# EAGLE design main (EAGLE 9.5.1)
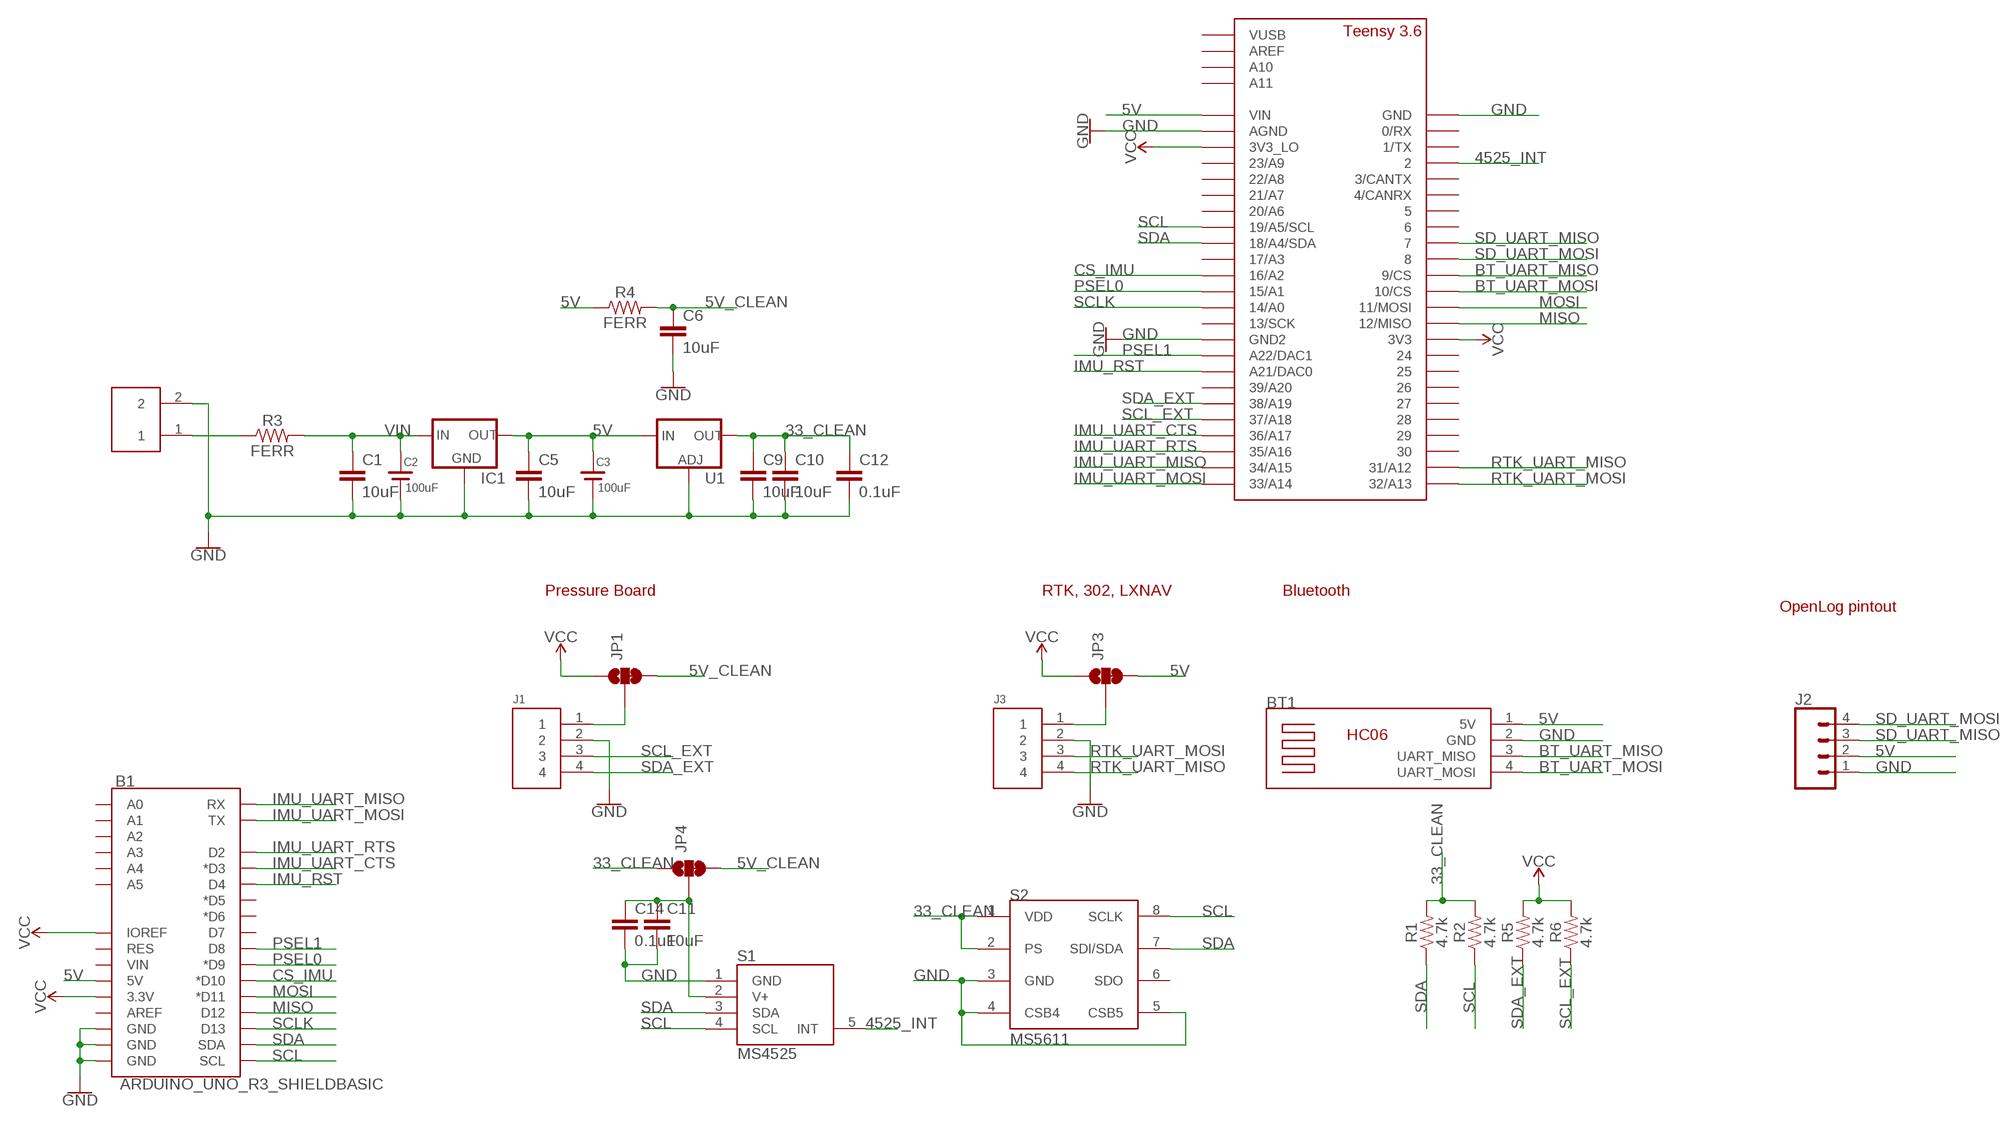
[diagram p0: schematic, sheet 1]

## Parts
B1  ARDUINO_UNO_R3_SHIELDBASIC  [UNO_R3_SHIELD]
BT1  HC06  [HC06]
C1  10uF  10UF-1206-6.3V-20%  [1206]
C2  100uF  CAP_POLARCAP_8_DIA_35_LEAD  [CAP_8MM_35MM]
C3  100uF  CAP_POLARCAP_8_DIA_35_LEAD  [CAP_8MM_35MM]
C5  10uF  10UF-1206-6.3V-20%  [1206]
C6  10uF  10UF-1206-6.3V-20%  [1206]
C9  10uF  10UF-1206-6.3V-20%  [1206]
C10  10uF  10UF-1206-6.3V-20%  [1206]
C11  10uF  10UF-1206-6.3V-20%  [1206]
C12  0.1uF  0.1UF-0603-25V-5%  [0603]
C14  0.1uF  0.1UF-0603-25V-5%  [0603]
IC1  V_REG_78XXR-78E  [V78W]
J1  HEADER4VALULOK  [4PINVALULOK]
J2  CONN_04  [1X04]
J3  HEADER4VALULOK  [4PINVALULOK]
JP1  JUMPER-SMT_3_1-NC_TRACE_SILK  [SMT-JUMPER_3_1-NC_TRACE_SILK]
JP3  JUMPER-SMT_3_1-NC_TRACE_SILK  [SMT-JUMPER_3_1-NC_TRACE_SILK]
JP4  JUMPER-SMT_3_1-NC_TRACE_SILK  [SMT-JUMPER_3_1-NC_TRACE_SILK]
R1  4.7k  4.7KOHM-0603-1/10W-1%  [0603]
R2  4.7k  4.7KOHM-0603-1/10W-1%  [0603]
R3  FERR  RESISTOR1206  [1206]
R4  FERR  RESISTOR1206  [1206]
R5  4.7k  4.7KOHM-0603-1/10W-1%  [0603]
R6  4.7k  4.7KOHM-0603-1/10W-1%  [0603]
S1  MS4525  MS4525MS4525DO  [DIP1270W53P254L990H762Q8B]
S2  MS5611  [MS5611]
U1  V_REG_317SMD  [SOT223]
U$1  TEENSY_3.5/3.6_BASIC  [TEENSY_3.5/3.6_BASIC]
U$3  HEADER2  [2PINVALULOK]

## Nets
5V: B1.5V BT1.1(5V) C3.POS(+) C5.1 IC1.OUT J2.2 JP3.3 R4.1 U1.3(IN) U$1.VIN
5V_CLEAN: C6.1 JP1.3 JP4.3 R4.2
33_CLEAN: C9.1 C10.1 C12.1 JP4.1 R1.2 R2.2 S2.1(VDD) S2.2(PS) U1.2(OUT)
4525_INT: S1.5(INT) U$1.2
BT_UART_MISO: BT1.3(UART_MISO) U$1.9/CS
BT_UART_MOSI: BT1.4(UART_MOSI) U$1.10/CS
CS_IMU: B1.D10(*D10) U$1.16/A2
GND: B1.GND@0(GND) B1.GND@1(GND) B1.GND@2(GND) BT1.2(GND) C1.2 C2.NEG(-) C3.NEG(-) C5.2 C6.2 C9.2 C10.2 C11.2 C12.2 C14.2 IC1.GND J1.2 J2.1 J3.2 S1.1(GND) S2.3(GND) S2.4(CSB4) S2.5(CSB5) U1.1(ADJ) U$1.AGND U$1.GND U$1.GND2 U$3.2
IMU_RST: B1.D4 U$1.21/DAC0(A21/DAC0)
IMU_UART_CTS: B1.D3(*D3) U$1.36/A17
IMU_UART_MISO: B1.RX U$1.34/A15
IMU_UART_MOSI: B1.TX U$1.33/A14
IMU_UART_RTS: B1.D2 U$1.35/A16
MISO: B1.D12 U$1.12/MISO
MOSI: B1.D11(*D11) U$1.11/MOSI
N$1: R3.1 U$3.1
N$2: J1.1 JP1.2
N$3: J3.1 JP3.2
N$4: C11.1 C14.1 JP4.2 S1.2(V+)
PSEL0: B1.D9(*D9) U$1.15/A1
PSEL1: B1.D8 U$1.A22/DAC1
RTK_UART_MISO: J3.4 U$1.31/A12
RTK_UART_MOSI: J3.3 U$1.32/A13
SCL: B1.SCL R2.1 S1.4(SCL) S2.8(SCLK) U$1.19/A5/SCL
SCL_EXT: J1.3 R6.1 U$1.37/A18
SCLK: B1.D13 U$1.14/A0
SD_UART_MISO: J2.3 U$1.7
SD_UART_MOSI: J2.4 U$1.8
SDA: B1.SDA R1.1 S1.3(SDA) S2.7(SDI/SDA) U$1.18/A4/SDA
SDA_EXT: J1.4 R5.1 U$1.38/A19
VCC: B1.3.3V B1.IOREF JP1.1 JP3.1 R5.2 R6.2 U$1.3V3 U$1.3V3_LO
VIN: C1.1 C2.POS(+) IC1.IN R3.2
Unconnected: B1.A0 B1.A1 B1.A2 B1.A3 B1.A4 B1.A5 B1.AREF B1.D5(*D5) B1.D6(*D6) B1.D7 B1.RES B1.VIN S2.6(SDO) U$1.0/RX U$1.1/TX U$1.3/CANTX U$1.4/CANRX U$1.5 U$1.6 U$1.13/SCK U$1.17/A3 U$1.20/A6 U$1.21/A7 U$1.22/A8 U$1.23/A9 U$1.24 U$1.25 U$1.26 U$1.27 U$1.28 U$1.29 U$1.30 U$1.39/A20 U$1.A10 U$1.A11 U$1.AREF U$1.VUSB

## Notes on the sheet
- Pressure Board | RTK, 302, LXNAV | Bluetooth
- OpenLog pintout

## Library data of the parts
B1 = SparkFun-Boards:ARDUINO_UNO_R3_SHIELD: Arduino R3 Shield Footprint Shield form compatible with the Arduino Uno R3. SparkFun Products: MG2639 Cellular Shield <https://www.sparkfun.com/products/13120> MIDI Shield <https://www.sparkfun.com/products/12898> R3 Stackable Headers Kit <https://www.sparkfun.com/products/11417>
BT1 = 2020:HC06
C1 C5 C6 C9-C11 = SparkFun-Capacitors:10UF: 10.0µF ceramic capacitors A capacitor is a passive two-terminal electrical component used to store electrical energy temporarily in an electric field.; PROD_ID: CAP-10057
C2 C3 = 2020:CAP_POLAR
C12 C14 = SparkFun-Capacitors:0.1UF: 0.1µF ceramic capacitors A capacitor is a passive two-terminal electrical component used to store electrical energy temporarily in an electric field.; PROD_ID: CAP-08604
IC1 = 2018:V_REG_78XX: Voltage Regulator Standard 7805 5V regulator. IGO (Input Ground Output). Spark Fun Electronics SKU : COM-00107
J1 J3 = Custom_old:HEADER4
J2 = SparkFun-Connectors:CONN_04: Multi connection point. Often used as Generic Header-pin footprint for 0.1 inch spaced/style header connections On any of the 0.1 inch spaced packages, you can populate with these: Break Away Headers - Straight <https://www.sparkfun.com/products/116> (PRT-00116) Break Away Male Headers - Right Angle <https://www.sparkfun.com/products/553> (PRT-00553) Female Headers <https://www.sparkfun.com/products/115> (PRT-00115) Break Away Headers - Machine Pin <https://www.sparkfun.com/products/117> (PRT-00117) Break Away Female Headers - Swiss Machine Pin <https://www.sparkfun.com/products/743> (PRT-00743) For SCREWTERMINALS and SPRING TERMINALS visit here: Screw Terimnals on SparkFun.com <https://www.sparkfun.com/search/results?term=Screw+Terminals> (5mm/3.5mm/2.54mm spacing) This device is also useful as a general connection point to wire up your design to another part of your project. Our various solder wires solder well into these plated through hole pads. Hook-Up Wire - Assortment (Stranded, 22 AWG) <https://www.sparkfun.com/products/11375> (PRT-11375) Hook-Up Wire - Assortment (Solid Core, 22 AWG) <https://www.sparkfun.com/products/11367> (PRT-11367) View the entire wire category on our website here <https://www.sparkfun.com/categories/141> Special notes: Molex polarized connector foot print use with SKU : PRT-08231 with associated crimp pins and housings. 1MM SMD Version SKU: PRT-10208; PROD_ID: CONN-09696
JP1 JP3 JP4 = SparkFun-Jumpers:JUMPER-SMT_3_1-NC_TRACE: Normally closed trace jumper (1 of 2 connections) This jumper has a trace between two pads so it's normally closed (NC). The other connection is normally open (NO). Use a razor knife to open the connection. For best results follow the IPC guidelines for cutting traces: Cutout at least 0.063 mm (0.005 in). Remove all loose material to clean up the cut area. Seal the cut with an approved epoxy. Reapply solder to reclose the connection, or to close the NO connection.
R1 R2 R5 R6 = SparkFun-Resistors:4.7KOHM: 4.7kΩ resistor A resistor is a passive two-terminal electrical component that implements electrical resistance as a circuit element. Resistors act to reduce current flow, and, at the same time, act to lower voltage levels within circuits. - Wikipedia; PROD_ID: RES-07857
R3 R4 = SparkFun-Resistors:RESISTOR: Generic Resistor Package
S1 = 2020:MS4525
S2 = Custom_old:MS5611
U1 = SparkFun-IC-Power:V_REG_317: Voltage Regulator Standard LM317 adjustable voltage regulator. AOI (Adjust Output Input). Google 'LM317 Calculator' for easy to use app to get the two resistor values needed. 240/720 for 5V output. 240/390 for 3.3V output. Spark Fun Electronics SKU : COM-00527
U$1 = Teensy356:TEENSY_3.5/3.6_BASIC
U$3 = Custom_old:HEADER2

## Board
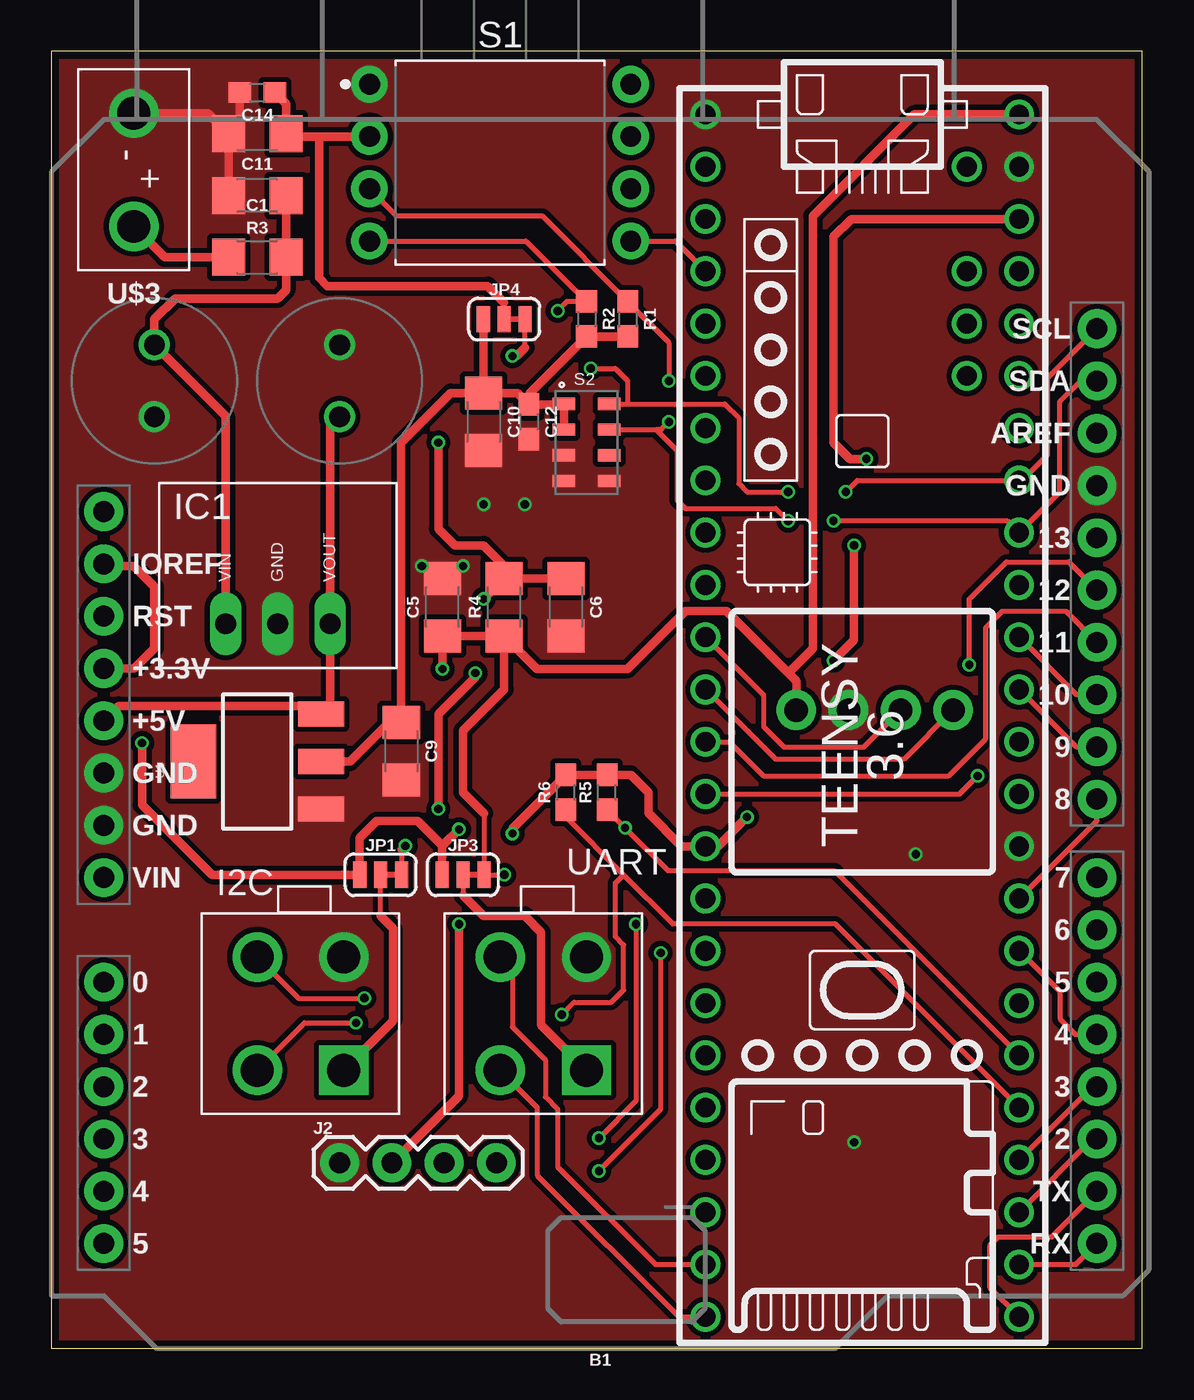
[diagram p1: board, top side]
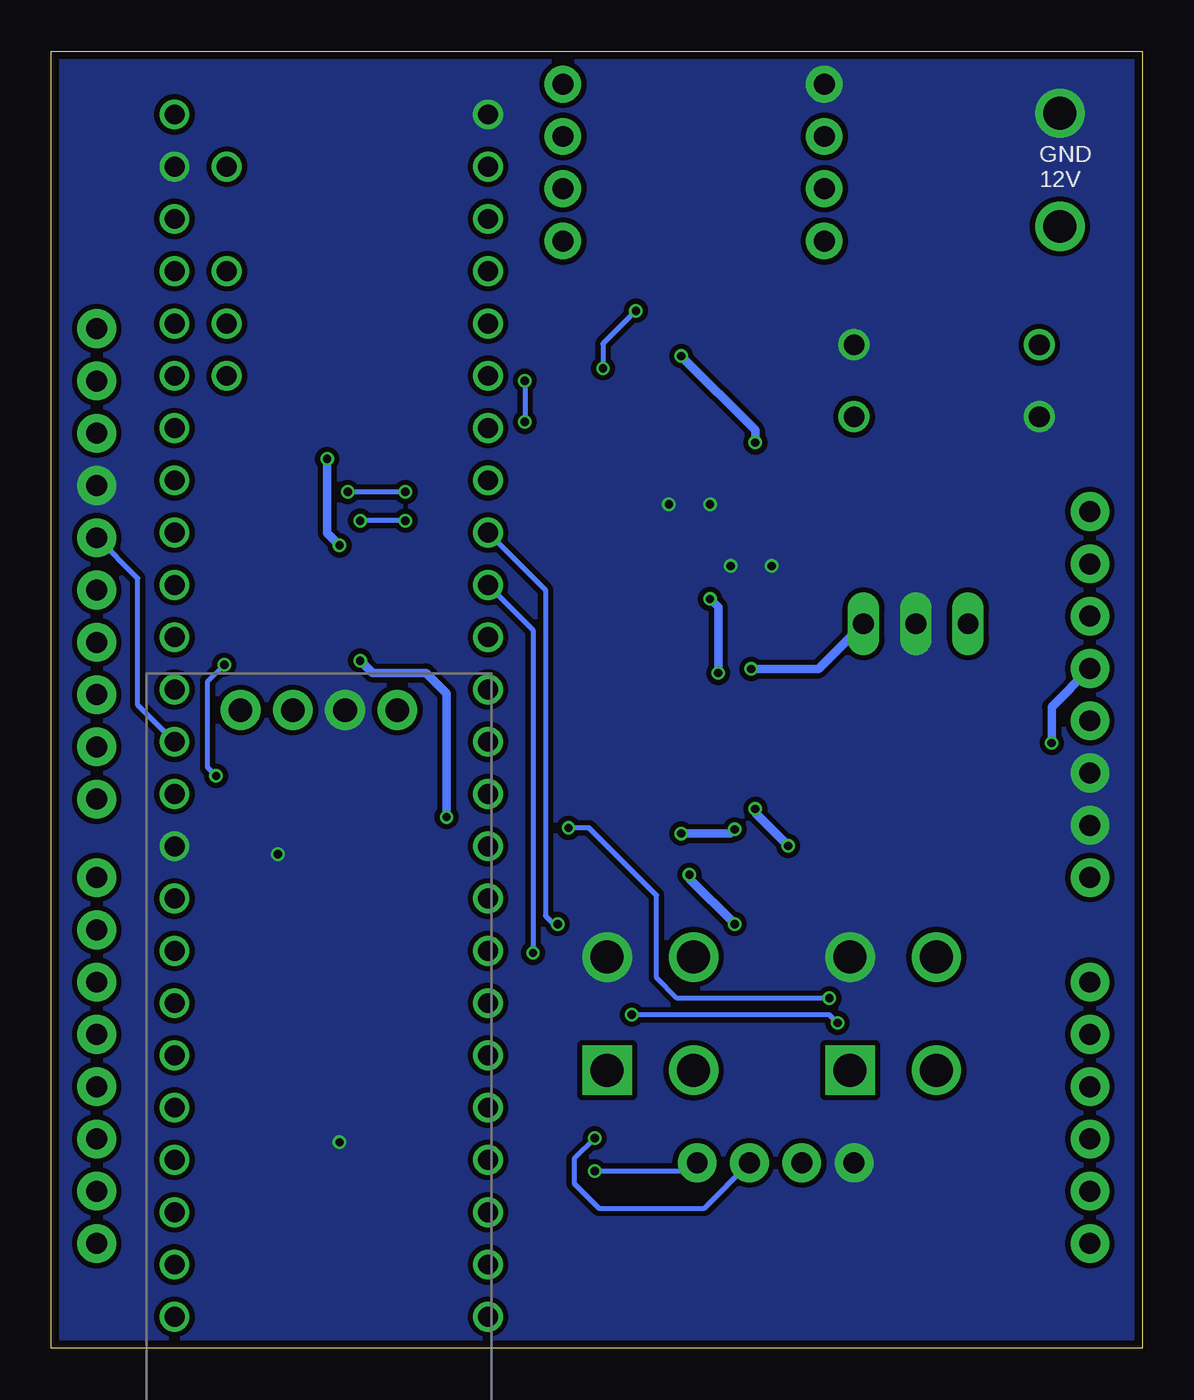
[diagram p2: board, bottom side, seen from below]

Size 53 x 63 mm. Coordinates in mm from the lower left corner, seen from the top.
Outline: 0,0 53,0 53,63 0,63 0,0
Copper layers (1*16): Top 0.035559375mm / dielectric 1.6mm / Bottom 0.035559375mm
Design rules "PATRICK-2lyr": minimum track width 6mil, minimum drill 10mil, track to track 6mil, track to pad 6mil, pad to pad 6mil, via to via 6mil, smd to smd 6mil, copper to edge 15mil, drill to drill 6mil, minimum pad ring 5mil, minimum via ring 5mil, stop-mask expansion 2.5mil, vias tented up to drill 25mil, thermal gap 10mil

### Footprints (pad centres in the part's own frame; a part is rotated, then mirrored left to right if it is on the bottom)
UNO_R3_SHIELD = drill 1.016 pad 1.88: 3.3V 24.13,-2.54; 5V 24.13,0; A0 24.13,12.7; A1 24.13,15.24; A2 24.13,17.78; A3 24.13,20.32; A4 24.13,22.86; A5 24.13,25.4; AREF -24.13,-13.97; D2 -24.13,20.32; D3 -24.13,17.78; D4 -24.13,15.24; D5 -24.13,12.7; D6 -24.13,10.16; D7 -24.13,7.62; D8 -24.13,3.81; D9 -24.13,1.27; D10 -24.13,-1.27; D11 -24.13,-3.81; D12 -24.13,-6.35; D13 -24.13,-8.89; GND@0 24.13,2.54; GND@1 24.13,5.08; GND@2 -24.13,-11.43; IOREF 24.13,-7.62; NC 24.13,-10.16; RES 24.13,-5.08; RX -24.13,25.4; SCL -24.13,-19.05; SDA -24.13,-16.51; TX -24.13,22.86; VIN 24.13,7.62
HC06 = drill 1.143 pad 1.93: 1 -3.81,0; 2 -1.27,0; 3 1.27,0; 4 3.81,0
1206 = smd 1.6 x 1.8: 1 -1.4,0; 2 1.4,0
CAP_8MM_35MM = drill 1: NEG 0,-1.75; POS 0,1.75
0603 = smd 1.1 x 1: 1 -0.85,0; 2 0.85,0
V78W = drill 1.016 long: GND 0,-3.81; IN -2.54,-3.81; OUT 2.54,-3.81
4PINVALULOK = drill 1.6 square: 1 0,5.5 | drill 1.6: 2 0,0; 3 4.2,5.5; 4 4.2,0
1X04 = drill 1.016 pad 1.88: 1 0,0; 2 2.54,0; 3 5.08,0; 4 7.62,0
SMT-JUMPER_3_1-NC_TRACE_SILK = smd 0.635 x 1.27: 1 -1.016,0; 2 0,0; 3 1.016,0
DIP1270W53P254L990H762Q8B = drill 1.016 pad 1.778: 1 -6.35,3.81; 2 -6.35,1.27; 3 -6.35,-1.27; 4 -6.35,-3.81; 5 6.35,-3.81; 6 6.35,-1.27; 7 6.35,1.27; 8 6.35,3.81
MS5611 = smd 1.1 x 0.6: 1 -1.1,1.875; 2 -1.1,0.625; 3 -1.1,-0.625; 4 -1.1,-1.875; 5 1.1,-1.875; 6 1.1,-0.625; 7 1.1,0.625; 8 1.1,1.875
SOT223 = smd 1.219 x 2.235: 1 -2.311,-3.099; 2 0,-3.099; 3 2.311,-3.099 | smd 3.6 x 2.2: 4 0,3.099
TEENSY_3.5/3.6_BASIC = drill 0.965: 0/RX -25.4,-7.62; 1/TX -22.86,-7.62; 2 -20.32,-7.62; 3/CANTX -17.78,-7.62; 3V3 7.62,-7.62; 3V3_LO -22.86,7.62; 4/CANRX -15.24,-7.62; 5 -12.7,-7.62; 6 -10.16,-7.62; 7 -7.62,-7.62; 8 -5.08,-7.62; 9/CS -2.54,-7.62; 10/CS 0,-7.62; 11/MOSI 2.54,-7.62; 12/MISO 5.08,-7.62; 13/SCK 5.08,7.62; 14/A0 2.54,7.62; 15/A1 0,7.62; 16/A2 -2.54,7.62; 17/A3 -5.08,7.62; 18/A4/SDA -7.62,7.62; 19/A5/SCL -10.16,7.62; 20/A6 -12.7,7.62; 21/A7 -15.24,7.62; 21/DAC0 12.7,7.62; 22/A8 -17.78,7.62; 23/A9 -20.32,7.62; 24 10.16,-7.62; 25 12.7,-7.62; 26 15.24,-7.62; 27 17.78,-7.62; 28 20.32,-7.62; 29 22.86,-7.62; 30 25.4,-7.62; 31/A12 27.94,-7.62; 32/A13 30.48,-7.62; 33/A14 30.48,7.62; 34/A15 27.94,7.62; 35/A16 25.4,7.62; 36/A17 22.86,7.62; 37/A18 20.32,7.62; 38/A19 17.78,7.62; 39/A20 15.24,7.62; A10 -17.78,5.08; A11 -15.24,5.08; A22/DAC1 10.16,7.62; AGND -25.4,7.62; AREF -20.32,5.08; GND -27.94,-7.62; GND2 7.62,7.62; VIN -27.94,7.62; VUSB -25.4,5.08
2PINVALULOK = drill 1.6: 1 0,5.5; 2 0,0

### Placement (x,y rotation side)
B1  26.67,30.48 180 top
BT1  40,31 180 bottom
C1  10,56 180 top
C2  5,47 0 top
C3  14,47 180 top
C5  19,36 90 top
C6  25,36 270 top
C9  17,29 270 top
C10  21,45 270 top
C11  10,59 180 top
C12  23.2,45 270 top
C14  10,61 180 top
IC1  11,39 0 top
J1  14.2,19 180 top
J2  14,9 0 top
J3  26,19 180 top
JP1  16,23 0 top
JP3  20,23 0 top
JP4  22,50 0 top
R1  28,50 270 top
R2  26,50 270 top
R3  10,53 0 top
R4  22,36 90 top
R5  27,27 90 top
R6  25,27 90 top
S1  21.8,57.6 0 top
S2  26,44 0 top
U1  10,28.5 90 top
U$1  39.4,32 270 top
U$3  4,60 180 top

### Tracks (layer width: path | path; a pad name or v marks a point on that pad's centre or on a via)
5V  (via drill 0.4)
  Top 0.254: 21.02,25.98 JP3.3 v22,23
  Top 0.406: C3.POS 13.54,44.79 IC1.OUT 13.54,31.25 13.14,30.86 | 13.14,30.86 U1.3 | R4.1 C5.1 v19,33 | R4.1 23.6,33 28,33 30.8,35.8 32.8,35.8 35.8,32.8 | 35.8,32.8 36.19,32.41 BT1.1 | U$1.VIN 41.94,59.94 37,55 37,34 35.8,32.8 | B1.5V 3.26,31.2 12.8,31.2 13.14,30.86 | 21.02,25.98 20,27 20,30 22,32 R4.1 | v19.8,20.6 19.8,12.26 J2.2
  Bottom 0.406: v19,33 15.73,33 IC1.OUT | v22,23 22,22.8 v19.8,20.6
5V_CLEAN  (via drill 0.4)
  Top 0.254: 23.02,48.62 JP4.3 | 17.02,24.22 JP1.3
  Top 0.406: 23.02,48.62 22.6,48.2 v22.4,48.2 | v18.8,44 18.8,39.8 19.6,39 21,39 22,38 R4.2 | C6.1 R4.2 | v17.2,24.4 17.02,24.22 | v18.8,26.2 18.8,30.8 20.6,32.6 v20.6,32.8 | v21,36.4 R4.2
  Bottom 0.406: v22.4,48.2 18.8,44.6 v18.8,44 | v17.2,24.4 18.8,26 v18.8,26.2 | v20.6,32.8 20.6,36 v21,36.4
33_CLEAN
  Top 0.406: U1.2 14.5,28.5 16.4,30.4 C9.1 17,44 19.4,46.4 C10.1 | C10.1 21,49.98 JP4.1 | C10.1 22.65,46.4 C12.1 | C12.1 24.88,45.85 S2.1 S2.2 | R1.2 R2.2 23.2,46.35 C12.1
4525_INT
  Top 0.254: S1.5 30.31,53.79 U$1.2
BT_UART_MISO
  Top 0.254: U$1.9/CS 34.6,31.72 34.6,30.2 35.6,29.2 39.47,29.2 BT1.3
BT_UART_MOSI
  Top 0.254: BT1.4 41.41,28.6 35.2,28.6 31.8,32 U$1.10/CS
CS_IMU
  Top 0.254: U$1.16/A2 49.81,31.75 B1.D10
GND  (via drill 0.4)
  Top 0.406: C11.2 C1.2 | U$3.2 7.6,60 C11.2 | C11.2 9.15,59.55 C14.2
  other vias: 18,38 20,38 21,41 23,41 42,24 39,10
  pour Top (isolate 0.254, no thermals): -1,64 54,64 54,-1 -1,-1
  pour Bottom (isolate 0.254, no thermals): -2,65 55,65 55,-2 -2,-2
IMU_RST
  Top 0.254: U$1.21/DAC0 49,17.32 49,16 49.76,15.24 B1.D4
IMU_UART_CTS
  Top 0.254: U$1.36/A17 50.58,12.7 B1.D3
IMU_UART_MISO
  Top 0.254: U$1.34/A15 49.78,4.06 B1.RX
IMU_UART_MOSI
  Top 0.254: U$1.33/A14 45.6,2.94 45.6,5 46,5.4 48.6,5.4 50.8,7.6 B1.TX
IMU_UART_RTS
  Top 0.254: U$1.35/A16 50.58,10.16 B1.D2
MISO  (via drill 0.4)
  Top 0.254: v45,27.8 44.12,26.92 U$1.12/MISO | v44.6,33.2 44.6,36.4 46.4,38.2 49.43,38.2 B1.D12
  Bottom 0.254: v45,27.8 45.4,28.2 45.4,32.4 v44.6,33.2
MOSI
  Top 0.254: U$1.11/MOSI 32.94,29.46 34.6,27.8 43.6,27.8 45.4,29.6 45.4,35 46.2,35.8 49.29,35.8 B1.D11
N$1
  Top 0.406: U$3.1 5.5,53 R3.1
N$2
  Top 0.254: 16,21 JP1.2
  Top 0.406: 16,21 16.6,20.4 16.6,15.9 J1.1
N$3
  Top 0.254: JP3.2 20,22
  Top 0.406: 20,22 21,21 23,21 23.8,20.2 23.8,15.7 J3.1
N$4
  Top 0.254: 22,50.8 JP4.2
  Top 0.406: C14.1 11.4,60.45 C11.1 11.53,58.87 13,58.87 | S1.2 13,58.87 | 13,58.87 13,52 13.4,51.6 21.2,51.6 22,50.8
PSEL0
  Top 0.254: U$1.15/A1 49.81,29.21 B1.D9
PSEL1
  Top 0.254: U$1.A22/DAC1 50.8,25.62 B1.D8
RTK_UART_MISO
  Top 0.254: J3.4 22.4,18.4 22.4,15.6 24,14 24,12.2 24.6,11.6 24.6,8.8 29.34,4.06 U$1.31/A12
RTK_UART_MOSI
  Top 0.254: U$1.32/A13 30.48,1.52 23.6,8.4 23.6,11.7 J3.3
SCL  (via drill 0.4)
  Top 0.254: S1.4 23.06,53.79 R2.1 25.05,50.85 v24.6,50.4 | B1.SCL 48.4,47.13 48.4,43.4 47.16,42.16 U$1.19/A5/SCL 39.16,42.16 v38.6,41.6 | S2.8 28,45.88 | 28,45.88 32.73,45.88 33.4,45.2 33.4,42 33.8,41.6 v35.8,41.6 | v26.2,47.6 27.4,47.6 28,47 28,45.88
  Bottom 0.254: v35.8,41.6 v38.6,41.6 | v24.6,50.4 26.2,48.8 v26.2,47.6
SCL_EXT  (via drill 0.4)
  Top 0.254: U$1.37/A18 38.1,20.6 30.2,20.6 27.8,23 | 27.8,23 25,25.8 R6.1 | J1.3 12.3,15.8 v14.8,15.8 | v24.8,16.2 25.4,16.8 27.2,16.8 27.8,17.4 27.8,19.6 27.4,20 27.4,22.6 27.8,23
  Bottom 0.254: v14.8,15.8 15.2,16.2 v24.8,16.2
SCLK
  Bottom 0.254: U$1.14/A0 48.8,31.24 48.8,37.4 50.77,39.37 B1.D13
SD_UART_MISO  (via drill 0.4)
  Top 0.254: v28.4,20.6 28.4,12 v26.6,10.2
  Bottom 0.254: U$1.7 29,36.84 29,21 28.6,20.6 v28.4,20.6 | v26.6,10.2 27.6,9.2 27.6,8 26.4,6.8 21.28,6.8 J2.3
SD_UART_MOSI  (via drill 0.4)
  Top 0.254: v29.6,19.2 29.6,11.6 v26.6,8.6
  Bottom 0.254: U$1.8 29.6,34.9 v29.6,19.2 | v26.6,8.6 22.02,8.6 J2.4
SDA  (via drill 0.4)
  Top 0.254: S1.3 16.78,55 23.85,55 R1.1 30,48.85 v30,47 | B1.SDA 49.99,46.99 49,46 49,41.6 U$1.18/A4/SDA 46.44,40.2 v38,40.2 | S2.7 29.38,44.62 | v35.8,40.2 35.2,40.8 30.8,40.8 30.4,41.2 30.4,43.6 29.38,44.62 | v30,45 29.62,44.62 29.38,44.62
  Bottom 0.254: v35.8,40.2 v38,40.2 | v30,47 v30,45
SDA_EXT  (via drill 0.4)
  Top 0.254: R5.1 v27.88,25.27 29.95,23.2 38.04,23.2 U$1.38/A19 | J1.4 12,17 v15.2,17
  Bottom 0.254: v15.2,17 22.6,17 23.6,18 23.6,22 26.88,25.27 v27.88,25.27
VCC  (via drill 0.4)
  Top 0.406: U$1.3V3_LO 38.86,54.86 38,54 38,44 38.8,43.2 v39.6,43.2 | v39,39 39,34.4 v38,33.4 | v33.8,25.8 32.38,24.38 U$1.3V3 30.62,24.38 29,26 29,27 28.15,27.85 R5.2 R6.2 22.4,25.25 v22.4,25 | B1.IOREF 2.64,38 4,38 5,37 5,34 4.02,33.02 B1.3.3V | v4.4,29.4 4.4,26.4 7.8,23 JP1.1 14.98,24.78 15.8,25.6 17.8,25.6 18.98,24.42 | 18.98,24.42 JP3.1 | v19.8,25.2 19.02,24.42 18.98,24.42
  Bottom 0.406: v39.6,43.2 39.6,39.6 v39,39 | v38,33.4 37.4,32.8 34.8,32.8 33.8,31.8 v33.8,25.8 | B1.3.3V 4.4,31.16 v4.4,29.4 | v22.4,25 20,25 v19.8,25.2
VIN
  Top 0.406: C1.1 R3.2 11.4,51.4 11,51 6,51 5,50 C2.POS 8.46,45.29 IC1.IN

### Text on the board
tPlace: UART | I2C
bPlace: GND / 12V